# EAGLE design centerpoint (EAGLE 9.6.2)
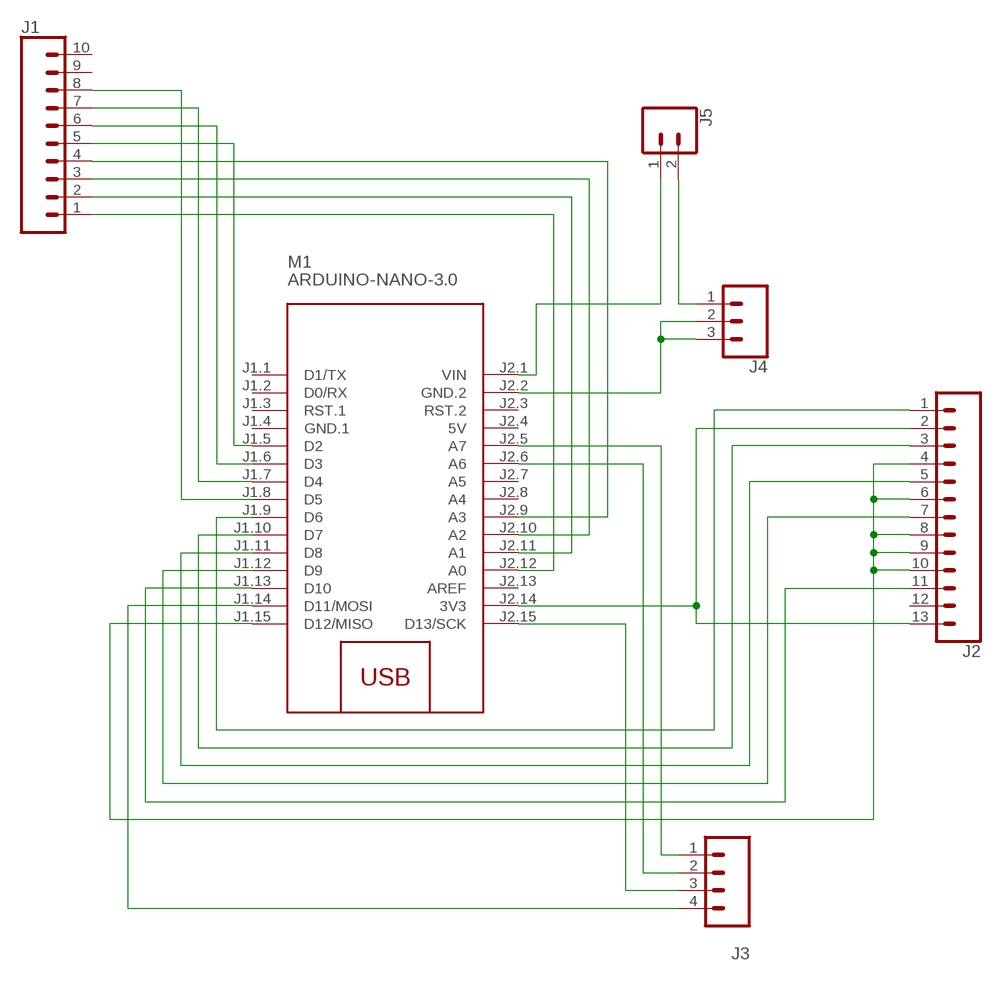
[diagram p0: schematic, sheet 1]

## Parts
J1  CONN_10"  [1X10]
J2  CONN_13  [1X13]
J3  CONN_04PTH  [1X04]
J4  CONN_03-SCREW-5MM  [SCREWTERMINAL-5MM-3]
J5  CONN_023.5MM  [SCREWTERMINAL-3.5MM-2]
M1  ARDUINO-NANO-3.0  [ARDUINO-NANO-3.0]

## Nets
N$1: J1.5 M1.J1.5(D2)
N$2: J1.6 M1.J1.6(D3)
N$3: J1.7 M1.J1.7(D4)
N$4: J1.8 M1.J1.8(D5)
N$5: J2.1 M1.J1.9(D6)
N$6: J2.3 M1.J1.10(D7)
N$7: J2.5 M1.J1.11(D8)
N$8: J2.7 M1.J1.12(D9)
N$9: J2.11 M1.J1.13(D10)
N$10: J3.4 M1.J1.14(D11/MOSI)
N$11: J2.4 J2.6 J2.8 J2.9 J2.10 M1.J1.15(D12/MISO)
N$12: J2.2 J2.13 M1.J2.14(3V3)
N$13: J1.1 M1.J2.12(A0)
N$14: J1.2 M1.J2.11(A1)
N$15: J1.3 M1.J2.10(A2)
N$16: J1.4 M1.J2.9(A3)
N$17: J3.1 M1.J2.5(A7)
N$18: J3.2 M1.J2.6(A6)
N$19: J3.3 M1.J2.15(D13/SCK)
N$20: J4.2 J4.3 M1.J2.2(GND.2)
N$21: J5.1 M1.J2.1(VIN)
N$22: J4.1 J5.2
Unconnected: J1.9 J1.10 J2.12 M1.J1.1(D1/TX) M1.J1.2(D0/RX) M1.J1.3(RST.1) M1.J2.3(RST.2) M1.J2.7(A5) M1.J2.8(A4) M1.J2.13(AREF)

## Power pins joined to a net without a drawn wire
5V: M1.J2.4(5V)
GND.1: M1.J1.4(GND.1)

## Library data of the parts
J1 = SparkFun-Connectors:CONN_10: Multi connection point. Often used as Generic Header-pin footprint for 0.1 inch spaced/style header connections On any of the 0.1 inch spaced packages, you can populate with these: Break Away Headers - Straight <https://www.sparkfun.com/products/116> (PRT-00116) Break Away Male Headers - Right Angle <https://www.sparkfun.com/products/553> (PRT-00553) Female Headers <https://www.sparkfun.com/products/115> (PRT-00115) Break Away Headers - Machine Pin <https://www.sparkfun.com/products/117> (PRT-00117) Break Away Female Headers - Swiss Machine Pin <https://www.sparkfun.com/products/743> (PRT-00743) Arduino Stackable Header - 10 Pin <https://www.sparkfun.com/products/11376> (PRT-11376) For SCREWTERMINALS and SPRING TERMINALS visit here: Screw Terimnals on SparkFun.com <https://www.sparkfun.com/search/results?term=Screw+Terminals> (5mm/3.5mm/2.54mm spacing) This device is also useful as a general connection point to wire up your design to another part of your project. Our various solder wires solder well into these plated through hole pads. Hook-Up Wire - Assortment (Stranded, 22 AWG) <https://www.sparkfun.com/products/11375> (PRT-11375) Hook-Up Wire - Assortment (Solid Core, 22 AWG) <https://www.sparkfun.com/products/11367> (PRT-11367) View the entire wire category on our website here <https://www.sparkfun.com/categories/141> Special notes: Molex polarized connector foot print use with SKU : PRT-08231 with associated crimp pins and housings. 1MM SMD Version SKU: PRT-10208 NOTES ON THE VARIANTS LOCK and LOCK_LONGPADS... This footprint was designed to help hold the alignment of a through-hole component (i.e. 6-pin header) while soldering it into place. You may notice that each hole has been shifted either up or down by 0.005 of an inch from it's more standard position (which is a perfectly straight line). This slight alteration caused the pins (the squares in the middle) to touch the edges of the holes. Because they are alternating, it causes a "brace" to hold the component in place. 0.005 has proven to be the perfect amount of "off-center" position when using our standard breakaway headers. Although looks a little odd when you look at the bare footprint, once you have a header in there, the alteration is very hard to notice. Also,if you push a header all the way into place, it is covered up entirely on the bottom side.; PROD_ID: CONN-11563
J2 = SparkFun-Connectors:CONN_13: Multi connection point. Often used as Generic Header-pin footprint for 0.1 inch spaced/style header connections On any of the 0.1 inch spaced packages, you can populate with these: Break Away Headers - Straight <https://www.sparkfun.com/products/116> (PRT-00116) Break Away Male Headers - Right Angle <https://www.sparkfun.com/products/553> (PRT-00553) Female Headers <https://www.sparkfun.com/products/115> (PRT-00115) Break Away Headers - Machine Pin <https://www.sparkfun.com/products/117> (PRT-00117) Break Away Female Headers - Swiss Machine Pin <https://www.sparkfun.com/products/743> (PRT-00743) For SCREWTERMINALS and SPRING TERMINALS visit here: Screw Terimnals on SparkFun.com <https://www.sparkfun.com/search/results?term=Screw+Terminals> (5mm/3.5mm/2.54mm spacing) This device is also useful as a general connection point to wire up your design to another part of your project. Our various solder wires solder well into these plated through hole pads. Hook-Up Wire - Assortment (Stranded, 22 AWG) <https://www.sparkfun.com/products/11375> (PRT-11375) Hook-Up Wire - Assortment (Solid Core, 22 AWG) <https://www.sparkfun.com/products/11367> (PRT-11367) View the entire wire category on our website here <https://www.sparkfun.com/categories/141> Special notes: Molex polarized connector foot print use with SKU : PRT-08231 with associated crimp pins and housings. 1MM SMD Version SKU: PRT-10208 NOTES ON THE VARIANTS LOCK and LOCK_LONGPADS... This footprint was designed to help hold the alignment of a through-hole component (i.e. 6-pin header) while soldering it into place. You may notice that each hole has been shifted either up or down by 0.005 of an inch from it's more standard position (which is a perfectly straight line). This slight alteration caused the pins (the squares in the middle) to touch the edges of the holes. Because they are alternating, it causes a "brace" to hold the component in place. 0.005 has proven to be the perfect amount of "off-center" position when using our standard breakaway headers. Although looks a little odd when you look at the bare footprint, once you have a header in there, the alteration is very hard to notice. Also,if you push a header all the way into place, it is covered up entirely on the bottom side.
J3 = SparkFun-Connectors:CONN_04: Multi connection point. Often used as Generic Header-pin footprint for 0.1 inch spaced/style header connections On any of the 0.1 inch spaced packages, you can populate with these: Break Away Headers - Straight <https://www.sparkfun.com/products/116> (PRT-00116) Break Away Male Headers - Right Angle <https://www.sparkfun.com/products/553> (PRT-00553) Female Headers <https://www.sparkfun.com/products/115> (PRT-00115) Break Away Headers - Machine Pin <https://www.sparkfun.com/products/117> (PRT-00117) Break Away Female Headers - Swiss Machine Pin <https://www.sparkfun.com/products/743> (PRT-00743) For SCREWTERMINALS and SPRING TERMINALS visit here: Screw Terimnals on SparkFun.com <https://www.sparkfun.com/search/results?term=Screw+Terminals> (5mm/3.5mm/2.54mm spacing) This device is also useful as a general connection point to wire up your design to another part of your project. Our various solder wires solder well into these plated through hole pads. Hook-Up Wire - Assortment (Stranded, 22 AWG) <https://www.sparkfun.com/products/11375> (PRT-11375) Hook-Up Wire - Assortment (Solid Core, 22 AWG) <https://www.sparkfun.com/products/11367> (PRT-11367) View the entire wire category on our website here <https://www.sparkfun.com/categories/141> Special notes: Molex polarized connector foot print use with SKU : PRT-08231 with associated crimp pins and housings. 1MM SMD Version SKU: PRT-10208; PROD_ID: CONN-09696
J4 = SparkFun-Connectors:CONN_03: Multi connection point. Often used as Generic Header-pin footprint for 0.1 inch spaced/style header connections On any of the 0.1 inch spaced packages, you can populate with these: Break Away Headers - Straight <https://www.sparkfun.com/products/116> (PRT-00116) Break Away Male Headers - Right Angle <https://www.sparkfun.com/products/553> (PRT-00553) Female Headers <https://www.sparkfun.com/products/115> (PRT-00115) Break Away Headers - Machine Pin <https://www.sparkfun.com/products/117> (PRT-00117) Break Away Female Headers - Swiss Machine Pin <https://www.sparkfun.com/products/743> (PRT-00743) Stackable Header - 3 Pin (Female, 0.1") <https://www.sparkfun.com/products/13875> (PRT-13875) For SCREWTERMINALS and SPRING TERMINALS visit here: Screw Terimnals on SparkFun.com <https://www.sparkfun.com/search/results?term=Screw+Terminals> (5mm/3.5mm/2.54mm spacing) This device is also useful as a general connection point to wire up your design to another part of your project. Our various solder wires solder well into these plated through hole pads. Hook-Up Wire - Assortment (Stranded, 22 AWG) <https://www.sparkfun.com/products/11375> (PRT-11375) Hook-Up Wire - Assortment (Solid Core, 22 AWG) <https://www.sparkfun.com/products/11367> (PRT-11367) View the entire wire category on our website here <https://www.sparkfun.com/categories/141> Special notes: Molex polarized connector foot print use with SKU : PRT-08232 with associated crimp pins and housings.; PROD_ID: CONN-10134; SF_SKU: PRT-08433
J5 = SparkFun-Connectors:CONN_02: Multi connection point. Often used as Generic Header-pin footprint for 0.1 inch spaced/style header connections On any of the 0.1 inch spaced packages, you can populate with these: Break Away Headers - Straight <https://www.sparkfun.com/products/116> (PRT-00116) Break Away Male Headers - Right Angle <https://www.sparkfun.com/products/553> (PRT-00553) Female Headers <https://www.sparkfun.com/products/115> (PRT-00115) Break Away Headers - Machine Pin <https://www.sparkfun.com/products/117> (PRT-00117) Break Away Female Headers - Swiss Machine Pin <https://www.sparkfun.com/products/743> (PRT-00743) For SCREWTERMINALS and SPRING TERMINALS visit here: Screw Terimnals on SparkFun.com <https://www.sparkfun.com/search/results?term=Screw+Terminals> (5mm/3.5mm/2.54mm spacing) This device is also useful as a general connection point to wire up your design to another part of your project. Our various solder wires solder well into these plated through hole pads. Hook-Up Wire - Assortment (Stranded, 22 AWG) <https://www.sparkfun.com/products/11375> (PRT-11375) Hook-Up Wire - Assortment (Solid Core, 22 AWG) <https://www.sparkfun.com/products/11367> (PRT-11367) View the entire wire category on our website here <https://www.sparkfun.com/categories/141> Special notes: Molex polarized connector foot print use with: PRT-08233 with associated crimp pins and housings. 2.54_SCREWTERM for use with PRT-10571. 3.5mm Screw Terminal footprints for PRT-08084 5mm Screw Terminal footprints for use with PRT-08432; PROD_ID: CONN-08399
M1 = diy-modules:ARDUINO-NANO-3.0: Arduino Nano 3.0 and compatible devices More details available here: https://www.arduino.cc/en/Main/ArduinoBoardNano Click here to find device on ebay.com <http://www.ebay.com/sch/arduino+nano>

## Board
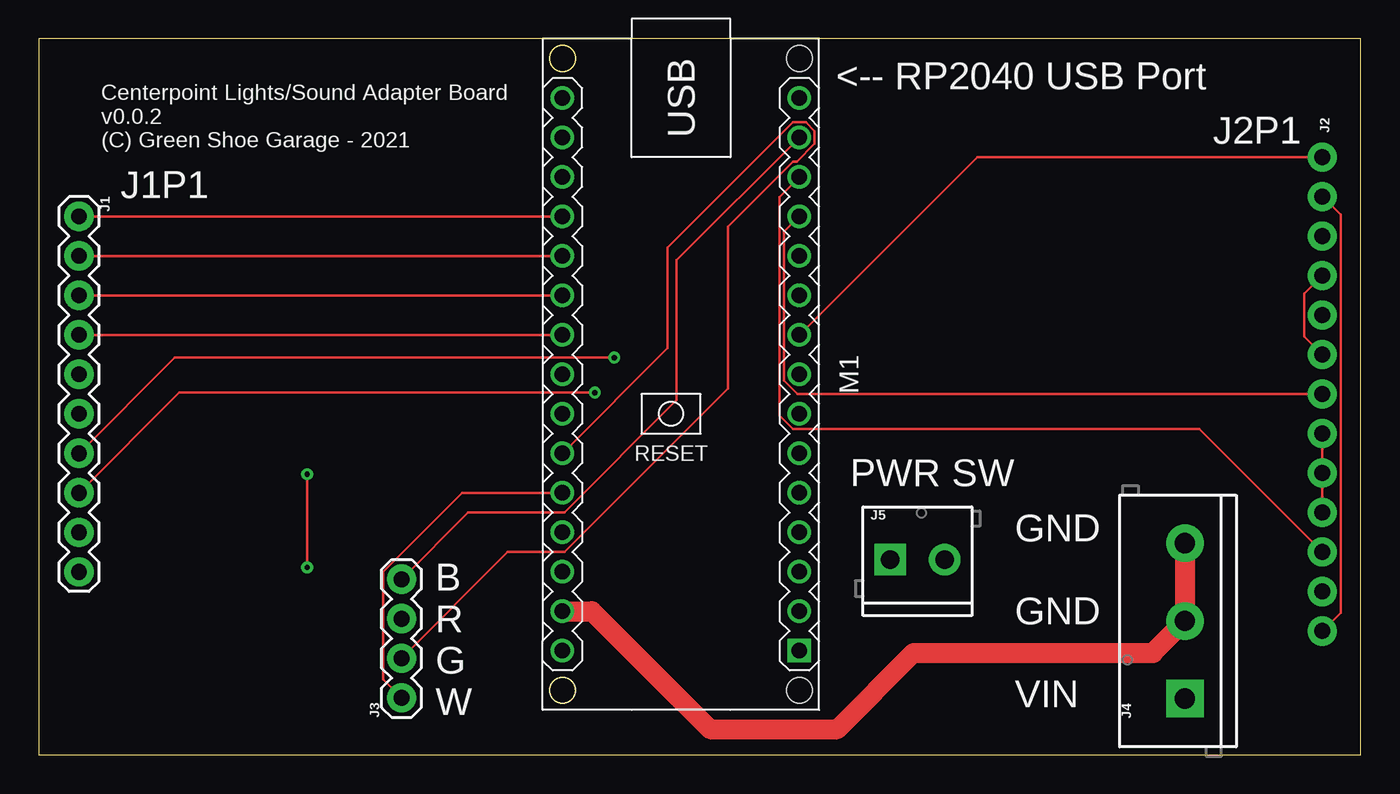
[diagram p1: board, top side]
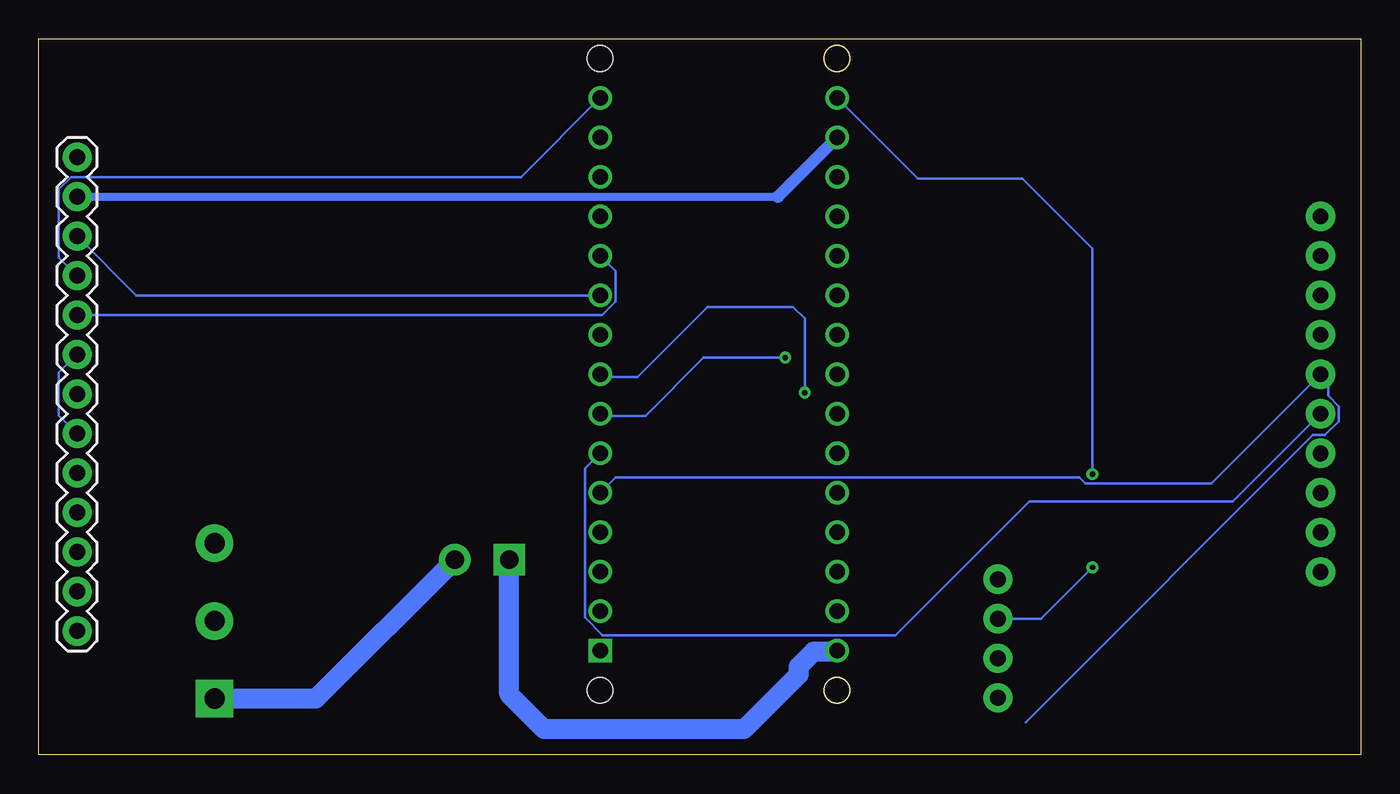
[diagram p2: board, bottom side, seen from below]

Size 85 x 46.06 mm. Coordinates in mm from the lower left corner, seen from the top.
Outline: 32.84,4.2 32.85,4.26 arc-170 34.5,4.2 34.5,4.13 arc-175 32.84,4.12 32.84,4.2
Outline: 0,46.06 0,0 85,0 85,46.06 0,46.06
Outline: circle at 33.67,44.8 radius 0.83
Copper layers (1*16): Top 0.035mm / dielectric 1.5mm / Bottom 0.035mm
Design rules "default": minimum track width 6mil, minimum drill 0.35mm, track to track 6mil, track to pad 6mil, pad to pad 6mil, via to via 6mil, smd to smd 6mil, copper to edge 40mil, drill to drill 6mil, minimum pad ring 10mil, minimum via ring 8mil, stop-mask expansion 4mil, vias tented up to drill 0mil, thermal gap 10mil
Holes 1.65 mm at 48.91,44.8 33.67,44.8 33.67,4.16 48.91,4.16 48.91,44.8 33.67,44.8 33.67,4.16 48.91,4.16 48.91,44.8 33.67,44.8 33.67,4.16 48.91,4.16 48.91,44.8 33.67,44.8 33.67,4.16 48.91,4.16 48.91,44.8 33.67,44.8 33.67,4.16 48.91,4.16 48.91,44.8 33.67,44.8 33.67,4.16 48.91,4.16 48.91,44.8 33.67,44.8 33.67,4.16 48.91,4.16 48.91,44.8 33.67,44.8 33.67,4.16 48.91,4.16 48.91,44.8 33.67,44.8 33.67,4.16 48.91,4.16 48.91,44.8 33.67,44.8 33.67,4.16 48.91,4.16 48.91,44.8 33.67,44.8 33.67,4.16 48.91,4.16 48.91,44.8 33.67,44.8 33.67,4.16 48.91,4.16 48.91,44.8 33.67,44.8 33.67,4.16 48.91,4.16 48.91,44.8 33.67,44.8 33.67,4.16 48.91,4.16 48.91,44.8 33.67,44.8 33.67,4.16 48.91,4.16 48.91,44.8 33.67,44.8 33.67,4.16 48.91,4.16 48.91,44.8 33.67,44.8 33.67,4.16 48.91,4.16 48.91,44.8 33.67,44.8 33.67,4.16 48.91,4.16 48.91,44.8 33.67,44.8 33.67,4.16 48.91,4.16 48.91,44.8 33.67,44.8 33.67,4.16 48.91,4.16 48.91,44.8 33.67,44.8 33.67,4.16 48.91,4.16 48.91,44.8 33.67,44.8 33.67,4.16 48.91,4.16 48.91,44.8 33.67,44.8 33.67,4.16 48.91,4.16 48.91,44.8 33.67,44.8 33.67,4.16 48.91,4.16 48.91,44.8 33.67,44.8 33.67,4.16 48.91,4.16 48.91,44.8 33.67,44.8 33.67,4.16 48.91,4.16 48.91,44.8 33.67,44.8 33.67,4.16 48.91,4.16 48.91,44.8 33.67,44.8 33.67,4.16 48.91,4.16 48.91,44.8 33.67,44.8 33.67,4.16 48.91,4.16 48.91,44.8 33.67,44.8 33.67,4.16 48.91,4.16 48.91,44.8 33.67,44.8 33.67,4.16 48.91,4.16 48.91,44.8 33.67,44.8 33.67,4.16 48.91,4.16 48.91,44.8 33.67,44.8 33.67,4.16 48.91,4.16 48.91,44.8 33.67,44.8 33.67,4.16 48.91,4.16 48.91,44.8 33.67,44.8 33.67,4.16 48.91,4.16 48.91,44.8 33.67,44.8 33.67,4.16 48.91,4.16 48.91,44.8 33.67,44.8 33.67,4.16 48.91,4.16 48.91,44.8 33.67,44.8 33.67,4.16 48.91,4.16 48.91,44.8 33.67,44.8 33.67,4.16 48.91,4.16 48.91,44.8 33.67,44.8 33.67,4.16 48.91,4.16 48.91,44.8 33.67,44.8 33.67,4.16 48.91,4.16 48.91,44.8 33.67,44.8 33.67,4.16 48.91,4.16 48.91,44.8 33.67,44.8 33.67,4.16 48.91,4.16 48.91,44.8 33.67,44.8 33.67,4.16 48.91,4.16 48.91,44.8 33.67,44.8 33.67,4.16 48.91,4.16 48.91,44.8 33.67,44.8 33.67,4.16 48.91,4.16 48.91,44.8 33.67,44.8 33.67,4.16 48.91,4.16 48.91,44.8 33.67,44.8 33.67,4.16 48.91,4.16 48.91,44.8 33.67,44.8 33.67,4.16 48.91,4.16 48.91,44.8 33.67,44.8 33.67,4.16 48.91,4.16 48.91,44.8 33.67,44.8 33.67,4.16 48.91,4.16 48.91,44.8 33.67,44.8 33.67,4.16 48.91,4.16 48.91,44.8 33.67,44.8 33.67,4.16 48.91,4.16 48.91,44.8 33.67,44.8 33.67,4.16 48.91,4.16 48.91,44.8 33.67,44.8 33.67,4.16 48.91,4.16 48.91,44.8 33.67,44.8 33.67,4.16 48.91,4.16 48.91,44.8 33.67,44.8 33.67,4.16 48.91,4.16 48.91,44.8 33.67,44.8 33.67,4.16 48.91,4.16 48.91,44.8 33.67,44.8 33.67,4.16 48.91,4.16 48.91,44.8 33.67,44.8 33.67,4.16 48.91,4.16 48.91,44.8 33.67,44.8 33.67,4.16 48.91,4.16 48.91,44.8 33.67,44.8 33.67,4.16 48.91,4.16 48.91,44.8 33.67,44.8 33.67,4.16 48.91,4.16 48.91,44.8 33.67,44.8 33.67,4.16 48.91,4.16 48.91,44.8 33.67,44.8 33.67,4.16 48.91,4.16 48.91,44.8 33.67,44.8 33.67,4.16 48.91,4.16 48.91,44.8 33.67,44.8 33.67,4.16 48.91,4.16 48.91,44.8 33.67,44.8 33.67,4.16 48.91,4.16 48.91,44.8 33.67,44.8 33.67,4.16 48.91,4.16 48.91,44.8 33.67,44.8 33.67,4.16 48.91,4.16 48.91,44.8 33.67,44.8 33.67,4.16 48.91,4.16 48.91,44.8 33.67,44.8 33.67,4.16 48.91,4.16 48.91,44.8 33.67,44.8 33.67,4.16 48.91,4.16 48.91,44.8 33.67,44.8 33.67,4.16 48.91,4.16 48.91,44.8 33.67,44.8 33.67,4.16 48.91,4.16 48.91,44.8 33.67,44.8 33.67,4.16 48.91,4.16 48.91,44.8 33.67,44.8 33.67,4.16 48.91,4.16 48.91,44.8 33.67,44.8 33.67,4.16 48.91,4.16 48.91,44.8 33.67,44.8 33.67,4.16 48.91,4.16 48.91,44.8 33.67,44.8 33.67,4.16 48.91,4.16 48.91,44.8 33.67,44.8 33.67,4.16 48.91,4.16 48.91,44.8 33.67,44.8 33.67,4.16 48.91,4.16 48.91,44.8 33.67,44.8 33.67,4.16 48.91,4.16 48.91,44.8 33.67,44.8 33.67,4.16 48.91,4.16 48.91,44.8 33.67,44.8 33.67,4.16 48.91,4.16 48.91,44.8 33.67,44.8 33.67,4.16 48.91,4.16 48.91,44.8 33.67,44.8 33.67,4.16 48.91,4.16 48.91,44.8 33.67,44.8 33.67,4.16 48.91,4.16 48.91,44.8 33.67,44.8 33.67,4.16 48.91,4.16 48.91,44.8 33.67,44.8 33.67,4.16 48.91,4.16 48.91,44.8 33.67,44.8 33.67,4.16 48.91,4.16 48.91,44.8 33.67,44.8 33.67,4.16 48.91,4.16 48.91,44.8 33.67,44.8 33.67,4.16 48.91,4.16 48.91,44.8 33.67,44.8 33.67,4.16 48.91,4.16 48.91,44.8 33.67,44.8 33.67,4.16 48.91,4.16 48.91,44.8 33.67,44.8 33.67,4.16 48.91,4.16 48.91,44.8 33.67,44.8 33.67,4.16 48.91,4.16 48.91,44.8 33.67,44.8 33.67,4.16 48.91,4.16 48.91,44.8 33.67,44.8 33.67,4.16 48.91,4.16 48.91,44.8 33.67,44.8 33.67,4.16 48.91,4.16 48.91,44.8 33.67,44.8 33.67,4.16 48.91,4.16 48.91,44.8 33.67,44.8 33.67,4.16 48.91,4.16 48.91,44.8 33.67,44.8 33.67,4.16 48.91,4.16 48.91,44.8 33.67,44.8 33.67,4.16 48.91,4.16 48.91,44.8 33.67,44.8 33.67,4.16 48.91,4.16 48.91,44.8 33.67,44.8 33.67,4.16 48.91,4.16 48.91,44.8 33.67,44.8 33.67,4.16 48.91,4.16 48.91,44.8 33.67,44.8 33.67,4.16 48.91,4.16 48.91,44.8 33.67,44.8 33.67,4.16 48.91,4.16 48.91,44.8 33.67,44.8 33.67,4.16 48.91,4.16 48.91,44.8 33.67,44.8 33.67,4.16 48.91,4.16 48.91,44.8 33.67,44.8 33.67,4.16 48.91,4.16 48.91,44.8 33.67,44.8 33.67,4.16 48.91,4.16 48.91,44.8 33.67,44.8 33.67,4.16 48.91,4.16 48.91,44.8 33.67,44.8 33.67,4.16 48.91,4.16 48.91,44.8 33.67,44.8 33.67,4.16 48.91,4.16 48.91,44.8 33.67,44.8 33.67,4.16 48.91,4.16 48.91,44.8 33.67,44.8 33.67,4.16 48.91,4.16 48.91,44.8 33.67,44.8 33.67,4.16 48.91,4.16 48.91,44.8 33.67,44.8 33.67,4.16 48.91,4.16 48.91,44.8 33.67,44.8 33.67,4.16 48.91,4.16 48.91,44.8 33.67,44.8 33.67,4.16 48.91,4.16 48.91,44.8 33.67,44.8 33.67,4.16 48.91,4.16 48.91,44.8 33.67,44.8 33.67,4.16 48.91,4.16 48.91,44.8 33.67,44.8 33.67,4.16 48.91,4.16 48.91,44.8 33.67,44.8 33.67,4.16 48.91,4.16 48.91,44.8 33.67,44.8 33.67,4.16 48.91,4.16 48.91,44.8 33.67,44.8 33.67,4.16 48.91,4.16 48.91,44.8 33.67,44.8 33.67,4.16 48.91,4.16 48.91,44.8 33.67,44.8 33.67,4.16 48.91,4.16 48.91,44.8 33.67,44.8 33.67,4.16 48.91,4.16 48.91,44.8 33.67,44.8 33.67,4.16 48.91,4.16 48.91,44.8 33.67,44.8 33.67,4.16 48.91,4.16 48.91,44.8 33.67,44.8 33.67,4.16 48.91,4.16 48.91,44.8 33.67,44.8 33.67,4.16 48.91,4.16 48.91,44.8 33.67,44.8 33.67,4.16 48.91,4.16 48.91,44.8 33.67,44.8 33.67,4.16 48.91,4.16 48.91,44.8 33.67,44.8 33.67,4.16 48.91,4.16 48.91,44.8 33.67,44.8 33.67,4.16 48.91,4.16 48.91,44.8 33.67,44.8 33.67,4.16 48.91,4.16 48.91,44.8 33.67,44.8 33.67,4.16 48.91,4.16 48.91,44.8 33.67,44.8 33.67,4.16 48.91,4.16 48.91,44.8 33.67,44.8 33.67,4.16 48.91,4.16 48.91,44.8 33.67,44.8 33.67,4.16 48.91,4.16 48.91,44.8 33.67,44.8 33.67,4.16 48.91,4.16 48.91,44.8 33.67,44.8 33.67,4.16 48.91,4.16 48.91,44.8 33.67,44.8 33.67,4.16 48.91,4.16 48.91,44.8 33.67,44.8 33.67,4.16 48.91,4.16 48.91,44.8 33.67,44.8 33.67,4.16 48.91,4.16 48.91,44.8 33.67,44.8 33.67,4.16 48.91,4.16 48.91,44.8 33.67,44.8 33.67,4.16 48.91,4.16 48.91,44.8 33.67,44.8 33.67,4.16 48.91,4.16 48.91,44.8 33.67,44.8 33.67,4.16 48.91,4.16 48.91,44.8 33.67,44.8 33.67,4.16 48.91,4.16 48.91,44.8 33.67,44.8 33.67,4.16 48.91,4.16 48.91,44.8 33.67,44.8 33.67,4.16 48.91,4.16 48.91,44.8 33.67,44.8 33.67,4.16 48.91,4.16 48.91,44.8 33.67,44.8 33.67,4.16 48.91,4.16 48.91,44.8 33.67,44.8 33.67,4.16 48.91,4.16 48.91,44.8 33.67,44.8 33.67,4.16 48.91,4.16 48.91,44.8 33.67,44.8 33.67,4.16 48.91,4.16 48.91,44.8 33.67,44.8 33.67,4.16 48.91,4.16

### Footprints (pad centres in the part's own frame; a part is rotated, then mirrored left to right if it is on the bottom)
1X10 = drill 1.016 pad 1.88: 1 0,0; 2 2.54,0; 3 5.08,0; 4 7.62,0; 5 10.16,0; 6 12.7,0; 7 15.24,0; 8 17.78,0; 9 20.32,0; 10 22.86,0
1X13 = drill 1.016 pad 1.88: 1 0,0; 2 2.54,0; 3 5.08,0; 4 7.62,0; 5 10.16,0; 6 12.7,0; 7 15.24,0; 8 17.78,0; 9 20.32,0; 10 22.86,0; 11 25.4,0; 12 27.94,0; 13 30.48,0
1X04 = drill 1.016 pad 1.88: 1 0,0; 2 2.54,0; 3 5.08,0; 4 7.62,0
SCREWTERMINAL-5MM-3 = drill 1.3 pad 2.413 square: 1 0,0 | drill 1.3 pad 2.413: 2 5,0; 3 10,0
SCREWTERMINAL-3.5MM-2 = drill 1.2 pad 2.032 square: 1 0,0 | drill 1.2 pad 2.032: 2 3.5,0
ARDUINO-NANO-3.0 = drill 1 square: J1.1 17.78,7.62 | drill 1: J1.2 15.24,7.62; J1.3 12.7,7.62; J1.4 10.16,7.62; J1.5 7.62,7.62; J1.6 5.08,7.62; J1.7 2.54,7.62; J1.8 0,7.62; J1.9 -2.54,7.62; J1.10 -5.08,7.62; J1.11 -7.62,7.62; J1.12 -10.16,7.62; J1.13 -12.7,7.62; J1.14 -15.24,7.62; J1.15 -17.78,7.62; J2.1 17.78,-7.62; J2.2 15.24,-7.62; J2.3 12.7,-7.62; J2.4 10.16,-7.62; J2.5 7.62,-7.62; J2.6 5.08,-7.62; J2.7 2.54,-7.62; J2.8 0,-7.62; J2.9 -2.54,-7.62; J2.10 -5.08,-7.62; J2.11 -7.62,-7.62; J2.12 -10.16,-7.62; J2.13 -12.7,-7.62; J2.14 -15.24,-7.62; J2.15 -17.78,-7.62 | hole 1.651: -20.32,7.62; -20.32,-7.62; 20.32,-7.62; 20.32,7.62

### Placement (x,y rotation side)
J1  2.58,34.64 270 top
J2  82.54,38.45 270 bottom
J3  23.32,3.68 90 top
J4  73.7,3.62 90 top
J5  54.75,12.56 0 top
M1  41.29,24.48 270 top

### Tracks (layer width: path | path; a pad name or v marks a point on that pad's centre or on a via)
N$1
  Bottom 0.152: 21.54,2.09 3.06,20.57 2.3,20.57 1.41,21.46 1.41,22.42 2.1,23.11 2.1,24 J1.5 9.61,17.45 17.71,17.45 18.1,17.84 47.93,17.84 M1.J1.5
N$2
  Bottom 0.152: M1.J1.6 49.89,18.42 49.89,8.83 48.74,7.68 29.91,7.68 21.29,16.3 8.21,16.3 J1.6
N$3  (via drill 0.35)
  Top 0.152: J1.7 8.74,25.56 v37,25.56
  Bottom 0.152: v37,25.56 42.25,25.56 46,21.81 48.78,21.81 M1.J1.7
N$4  (via drill 0.35)
  Top 0.152: J1.8 9.03,23.31 v35.75,23.31 36,23.31
  Bottom 0.152: v35.75,23.31 35.75,28.06 36.5,28.81 42,28.81 46.5,24.31 48.74,24.31 M1.J1.8
N$5
  Top 0.152: J2.1 60.34,38.45 M1.J1.9
N$6
  Bottom 0.152: J2.3 78.73,29.56 M1.J1.10
N$7
  Bottom 0.152: J2.5 48.79,28.29 47.93,29.15 47.93,31.12 M1.J1.11
N$8
  Top 0.152: J2.7 48.79,23.21 47.93,24.07 47.93,33.66 M1.J1.12
N$9
  Top 0.152: J2.11 74.63,20.96 48.5,20.96 47.62,21.84 47.62,35.89 M1.J1.13
N$10
  Top 0.152: M1.J1.14 41.02,31.83 41.02,22.82 33.79,15.59 27.61,15.59 J3.4
N$11
  Top 0.152: J2.6 81.37,26.92 81.37,29.66 J2.4 | J2.8 J2.9 J2.10
  Bottom 0.152: J2.4 83.71,32 83.71,36.39 82.92,37.18 53.99,37.18 M1.J1.15 | J2.8 83.71,21.84 83.71,24.58 J2.6
N$12
  Top 0.152: J2.13 83.71,9.14 83.71,34.74 J2.2
  Bottom 0.508: J2.2 37.48,35.91
  Bottom 0.813: 37.48,35.91 M1.J2.14
N$13
  Top 0.152: M1.J2.12 J1.1
N$14
  Top 0.152: M1.J2.11 J1.2
N$15
  Top 0.152: M1.J2.10 J1.3
N$16
  Top 0.152: M1.J2.9 J1.4
N$17
  Top 0.152: M1.J2.5 27.23,16.86 22.15,11.78 22.15,4.85 J3.1
N$18
  Top 0.152: M1.J2.6 40.44,26.17 40.44,32.64 48.5,40.7 49.32,40.7 49.89,40.13 49.89,39.31 48.74,38.16 48.5,38.16 44.32,33.98 44.32,23.58 33.79,13.05 30.15,13.05 J3.2
N$19  (via drill 0.35)
  Top 0.152: v17.25,18.06 v17.25,12.06
  Bottom 0.152: J3.3 20.55,8.76 v17.25,12.06 | M1.J2.15 28.47,37.06 21.75,37.06 17.25,32.56 v17.25,18.06
N$20
  Top 1.27: J4.3 J4.2 71.64,6.56 56.25,6.56 51.34,1.65 43.16,1.65 35.57,9.24 M1.J2.2
N$21
  Bottom 1.27: M1.J2.1 33.73,6.64 35.18,6.64 36.15,5.67 36.15,5.16 39.66,1.65 52.5,1.65 54.75,3.9 J5.1
N$22
  Bottom 1.27: J5.2 67.19,3.62 J4.1

### Text on the board
tNames: <-- RP2040 USB Port | Centerpoint Lights/Sound Adapter Board / v0.0.2 / (C) Green Shoe Garage - 2021 | J2P1 | J1P1 | PWR SW | GND / / GND / / VIN | B / R / G / W